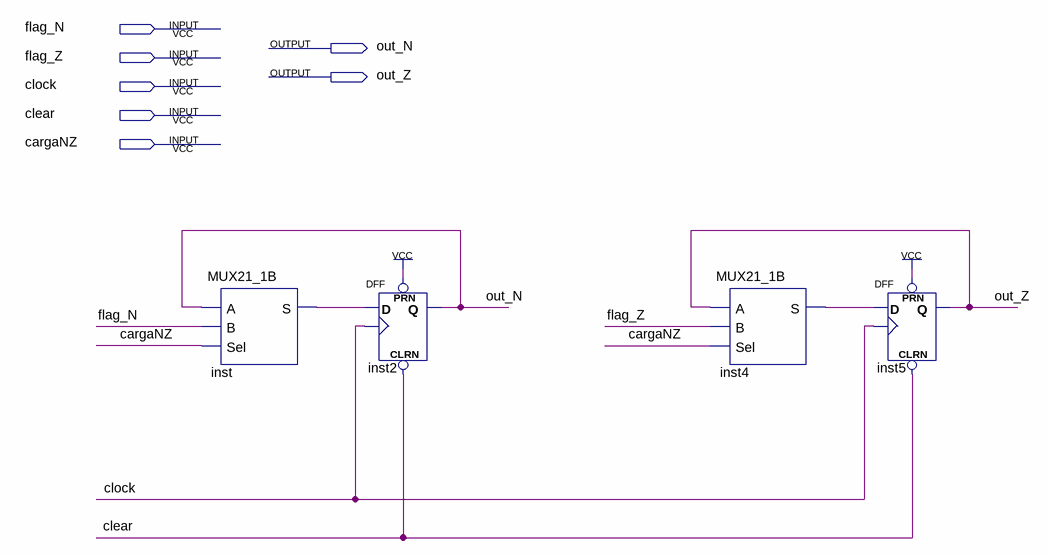
[diagram p0: schematic sheet]
// Quartus schematic REG_FLAGS_NZ.bdf as structural Verilog: 4 symbols, 7 pins
module REG_FLAGS_NZ (
  input  flag_N,
  input  flag_Z,
  input  clock,
  input  clear,
  input  cargaNZ,
  output out_N,
  output out_Z
);

  wire inst4_s, inst_s;

  MUX21_1B inst (.A(out_N), .B(flag_N), .Sel(cargaNZ), .S(inst_s));
  DFF inst2 (.CLRN(clear), .CLK(clock), .D(inst_s), .PRN(1'b1), .Q(out_N));
  MUX21_1B inst4 (.A(out_Z), .B(flag_Z), .Sel(cargaNZ), .S(inst4_s));
  DFF inst5 (.CLRN(clear), .CLK(clock), .D(inst4_s), .PRN(1'b1), .Q(out_Z));
endmodule
